# EAGLE design Ephys (EAGLE 9.6.2)
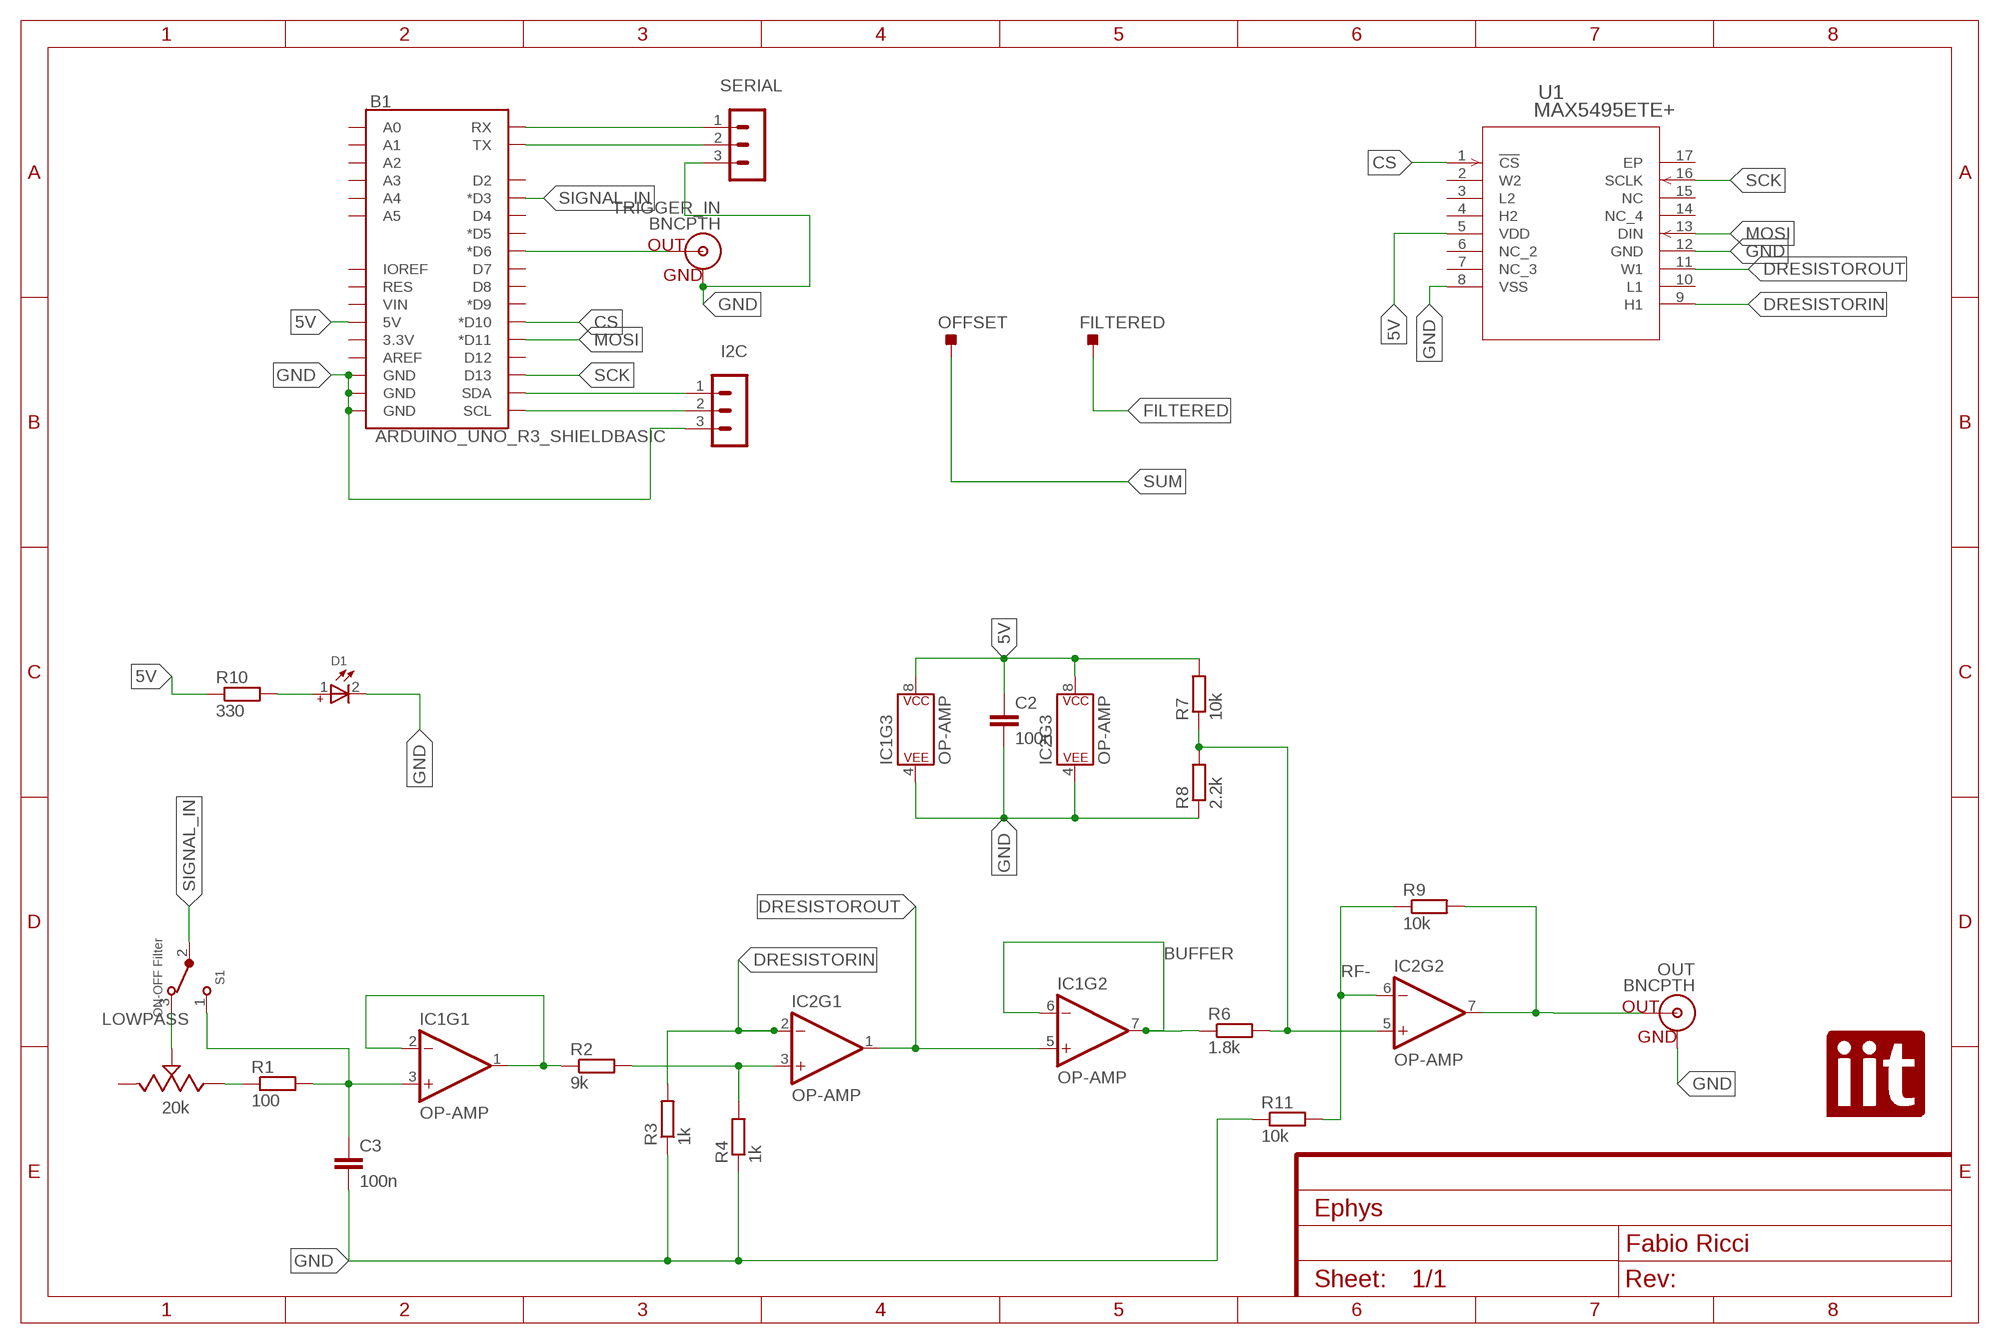
[diagram p0: schematic, sheet 1]
FRAME1 (FRAME-A4L): DESIGNER: Fabio Ricci

## Parts
B1  ARDUINO_UNO_R3_SHIELDBASIC  [UNO_R3_SHIELD]
C2  100n  C-EU025-025X050  [C025-025X050]
C3  100n  C-EU025-025X050  [C025-025X050]
D1  WL-TMRC_3MM_151031SS04000_WITHOUTSTOPPER  [WL-TMRC_3MM]
FILTERED  TESTPOINT_TPS-PAD-036  [TESTPOINT_PAD-036]
I2C  MA03-1  [MA03-1]
IC1  OP-AMP  OPAMP-DUALDIP  [DIP08]
IC2  OP-AMP  OPAMP-DUALDIP  [DIP08]
LOWPASS  20k  3362P-1-103LF  [3362P-1-103LF]
OFFSET  TESTPOINT_TPS-PAD-036  [TESTPOINT_PAD-036]
OUT  BNCPTH  [BNC]
R1  100  R-EU_0204/7  [0204/7]
R2  9k  R-EU_0204/7  [0204/7]
R3  1k  R-EU_0204/7  [0204/7]
R4  1k  R-EU_0204/7  [0204/7]
R6  1.8k  R-EU_0204/7  [0204/7]
R7  10k  R-EU_0204/7  [0204/7]
R8  2.2k  R-EU_0204/7  [0204/7]
R9  10k  R-EU_0204/7  [0204/7]
R10  330  R-EU_0204/7  [0204/7]
R11  10k  R-EU_0204/7  [0204/7]
S1  ON-OFF Filter  472121010111  [472121010111]
SERIAL  MA03-1  [MA03-1]
TRIGGER_IN  BNCPTH  [BNC]
U1  MAX5495ETE+  [21-0140_T1655+3_MXM]
U$1  LOGO  [IIT]

## Nets
5V: B1.5V C2.1 IC1.8(P$V+) IC2.8(P$V+) R7.2 R10.1 U1.5(VDD)
BUFFER: IC1.6(-IN) IC1.7(OUT) R6.1
CS: B1.D10(*D10) U1.1(!CS)
DRESISTORIN: IC2.2(-IN) R3.2 U1.9(H1)
DRESISTOROUT: IC1.5(+IN) IC2.1(OUT) U1.11(W1)
FILTERED: C3.1 FILTERED.1(TP) IC1.3(+IN) R1.2 S1.1
GND: B1.GND@0(GND) B1.GND@1(GND) B1.GND@2(GND) C2.2 C3.2 D1.2(-) I2C.3 IC1.4(P$V-) IC2.4(P$V-) OUT.GND R3.1 R4.1 R8.1 R11.1 SERIAL.3 TRIGGER_IN.GND U1.8(VSS) U1.12(GND)
MOSI: B1.D11(*D11) U1.13(DIN)
N$2: IC1.1(OUT) IC1.2(-IN) R2.1
N$3: IC2.3(+IN) R2.2 R4.2
N$4: B1.D6(*D6) TRIGGER_IN.S(OUT)
N$5: B1.SDA I2C.1
N$6: B1.SCL I2C.2
N$7: B1.RX SERIAL.1
N$8: LOWPASS.3 R1.1
N$9: D1.1(+) R10.2
N$10: LOWPASS.2 S1.3
N$11: B1.TX SERIAL.2
OUT: IC2.7(OUT) OUT.S(OUT) R9.2
RF-: IC2.6(-IN) R9.1 R11.2
SCK: B1.D13 U1.16(SCLK)
SIGNAL_IN: B1.D3(*D3) S1.2
SUM: IC2.5(+IN) OFFSET.1(TP) R6.2 R7.1 R8.2
Unconnected: B1.3.3V B1.A0 B1.A1 B1.A2 B1.A3 B1.A4 B1.A5 B1.AREF B1.D2 B1.D4 B1.D5(*D5) B1.D7 B1.D8 B1.D9(*D9) B1.D12 B1.IOREF B1.RES B1.VIN LOWPASS.1 U1.2(W2) U1.3(L2) U1.4(H2) U1.6(NC_2) U1.7(NC_3) U1.10(L1) U1.14(NC_4) U1.15(NC) U1.17(EP)

## Library data of the parts
B1 = SparkFun-Boards:ARDUINO_UNO_R3_SHIELD: Arduino R3 Shield Footprint Shield form compatible with the Arduino Uno R3. SparkFun Products: MG2639 Cellular Shield <https://www.sparkfun.com/products/13120> MIDI Shield <https://www.sparkfun.com/products/12898> R3 Stackable Headers Kit <https://www.sparkfun.com/products/11417>
C2 C3 = rcl:C-EU: CAPACITOR, European symbol; SPICEPREFIX: C
D1 = Wurth_LEDs_WL-TMRC:WL-TMRC_3MM: WL-TMRC THT Mono-color Round Color Characteristics Low energy consumption High reliability Low current requirement Fast switching No UV/IR radiation Easy installation LED without stopper Variety of lens colors Variety of viewing angle Applications Status light Light guide design Commercial advertising Decorative lighting Interior and exterior lighting Outdoor LED panels Instrumentation and front panel indicator Traffic signal light Electronic and communication appliance Toys <https://www.we-online.com/catalog/media/o64621v209%20Family_WL_TMRC_THT.jpg> Details see: www.we-online.com/katalog/WL-TMRC <www.we-online.com/catalog/WL-TMRC/?utm_source=eagle_model&utm_medium=description_link&utm_campaign=eisos_eagle> Updated by Ella Wu, 2022-06-21 2022(C) Wurth Elektronik; CHIP-TECHNOLOGY: AlInGaP; DATASHEET-URL: https://www.we-online.com/redexpert/spec/151031SS04000?ae; DOMINANT-WAVELENGTH: 635nm; EMITTING-COLOR: Super Red; FORWARD-VOLTAGE: 2V; LUMINOUS-INTENSITY: 160mcd; MOUNT: THT; PART-NUMBER: 151031SS04000; PEAK-WAVELENGTH: 640nm; VALUE: 151031SS04000; VIEWING-ANGLE: 40°
FILTERED OFFSET = 52101-101-REV-A_v16:TESTPOINT_TPS: TEST POINT PAD; BOM: EXCLUDE
I2C SERIAL = con-lstb:MA03-1: PIN HEADER; OC_FARNELL: unknown; OC_NEWARK: unknown
IC1 IC2 = SparkFun-IC-Amplifiers:OPAMP-DUAL: Generic op-amp footprint This component is for the standard 358 pinning of a dual op-amp From the LM358 datasheet: Pin 1: Output A Pin 2: Inverting Input A Pin 3: Non-Inverting Input A Pin 4: Gnd Pin 5: Non-Inverting Input B Pin 6: Inverting Input B Pin 7: Output B Pin 8: V+; PROD_ID: NA-XXXXX
LOWPASS = Potentiometer_Trimmers:3362P-1-103LF: TRIMMER 10K OHM 0.5W PC PIN TOP Manufacturer's datasheet <https://www.bourns.com/docs/Product-Datasheets/3362.pdf>; CREATED_PN: PCBLayout.com; DIGIKEY_PN: 3362P-103LF-ND; MANUFACTURER: Bourns Inc.; MPN: 3362P-1-103LF
OUT TRIGGER_IN = SparkFun-Connectors:BNC: BNC Right Angle Connector Mouser Part# 5227161 SparkFun Products: BNC Connector - Right Angle <https://www.sparkfun.com/products/10550>; PROD_ID: LPA-12729; SF_ID: PRT-10550
R1-R4 R6-R11 = resistor:R-EU_: RESISTOR, European symbol
S1 = Wurth_Switch_WS-TOTV:472121010111: WS-TOTV Ø 6.35mm Panel Cut-Out Vertical Operation Toggle Switch Material Properties Actuator Material Copper Alloy Cover Material Stainless Steel Frame Material DAP Frame Flammability Rating UL94 V-0 Moveable Contact Material Copper Alloy Moveable Contact Plating Silver Stationary Contact Material Copper Alloy Stationary Contact Plating Silver Terminal Material Copper Alloy Terminal Plating Silver Electrical Properties IR 1 A VR 30 V (DC) Contact Resistance Initial 30 mΩ RISO 1000 MΩ Withstanding Voltage 500 V (AC) Mechanical Properties Electrical Life 50000 Steps Connection Type Opposite Side Connection General Information Operating Temperature -40 up to +85 °C <https://www.we-online.com/catalog/media/o718996v209%20family-totv-4721xx0x0xxx.jpg> Details see: www.we-online.com/components/products/WS-TOTV_635_CUT_OUT_VERT_OPERATION <https://www.we-online.com/en/components/products/WS-TOTV_635_CUT_OUT_VERT_OPERATION> Updated by Ella Wu 2022-11-11 2022(C) Würth Elektronik; ACTUATOR-LENGTH: 10.4mm; BUSHING-LENGTH: 9mm; DATASHEET-URL: https://www.we-online.com/redexpert/spec/472121010111?ae; MOUNT: THT; PART-NUMBER: 472121010111; SWITCHING-FUNCTION: ON-ON; VALUE: 472121010111
U1 = Max5495:MAX5495ETE+; COPYRIGHT: Copyright (C) 2024 Ultra Librarian. All rights reserved.; MANUFACTURER_PART_NUMBER: MAX5495ETE+; MFR_NAME: Analog Devices Inc
U$1 = LOGO:LOGO

## Board
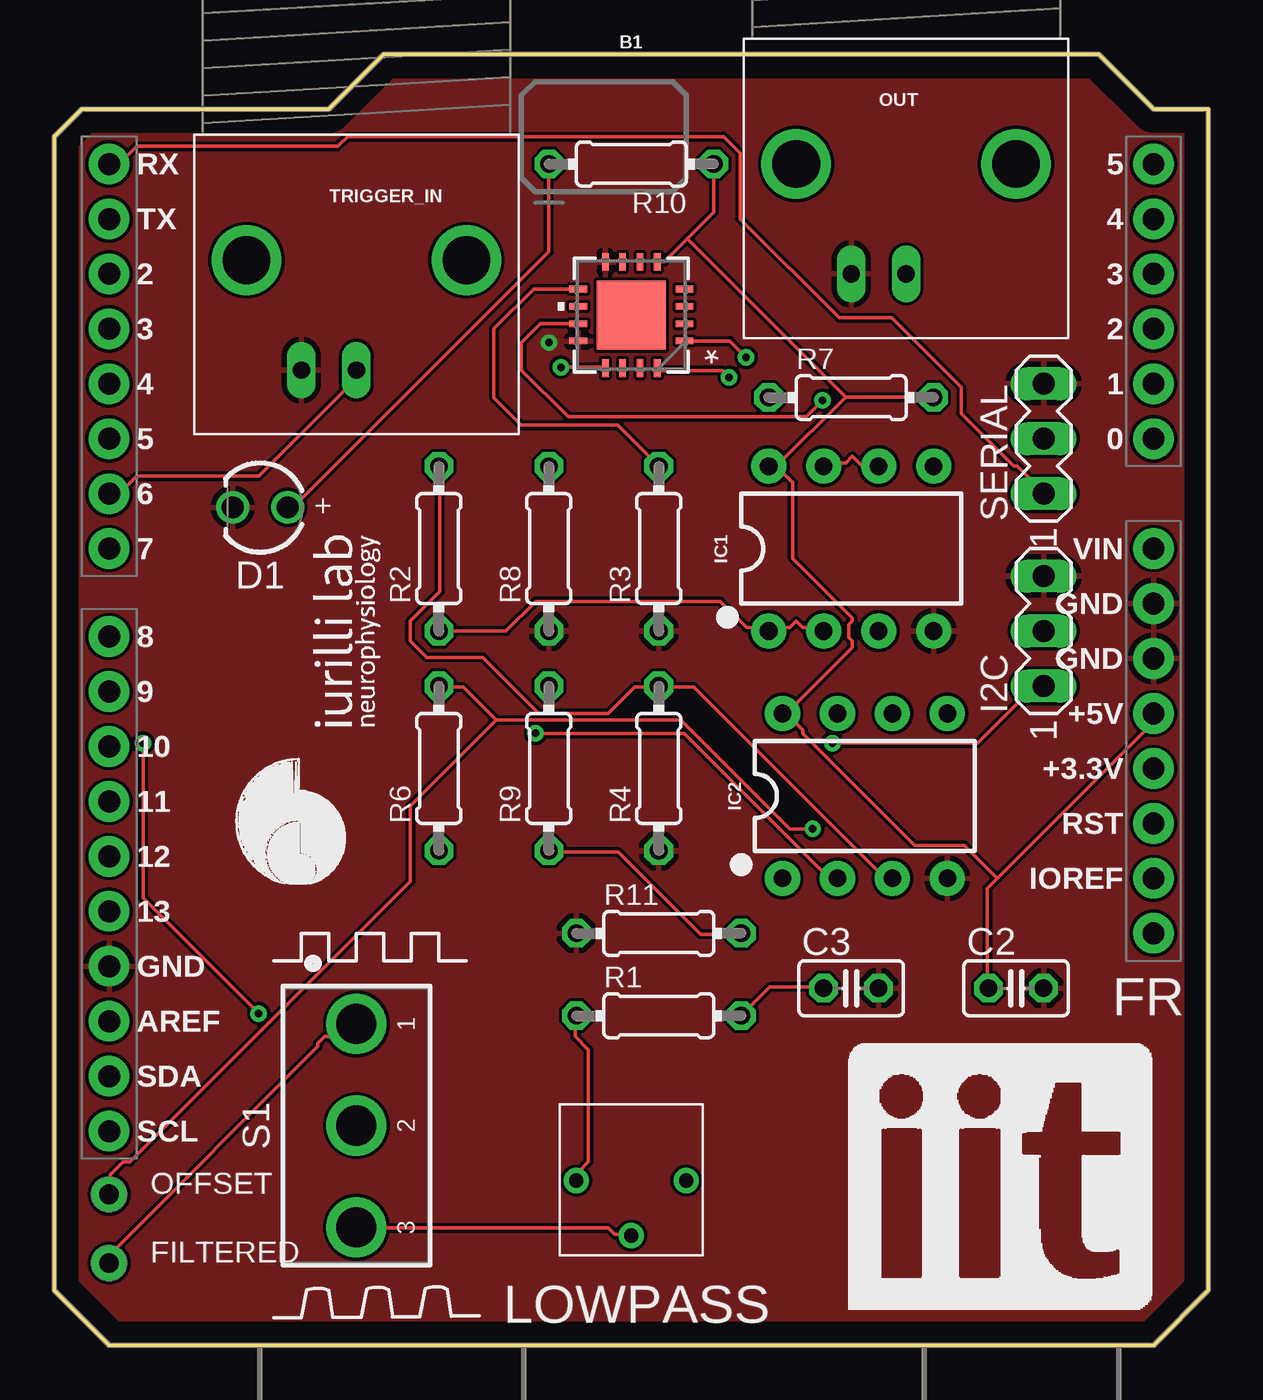
[diagram p1: board, top side]
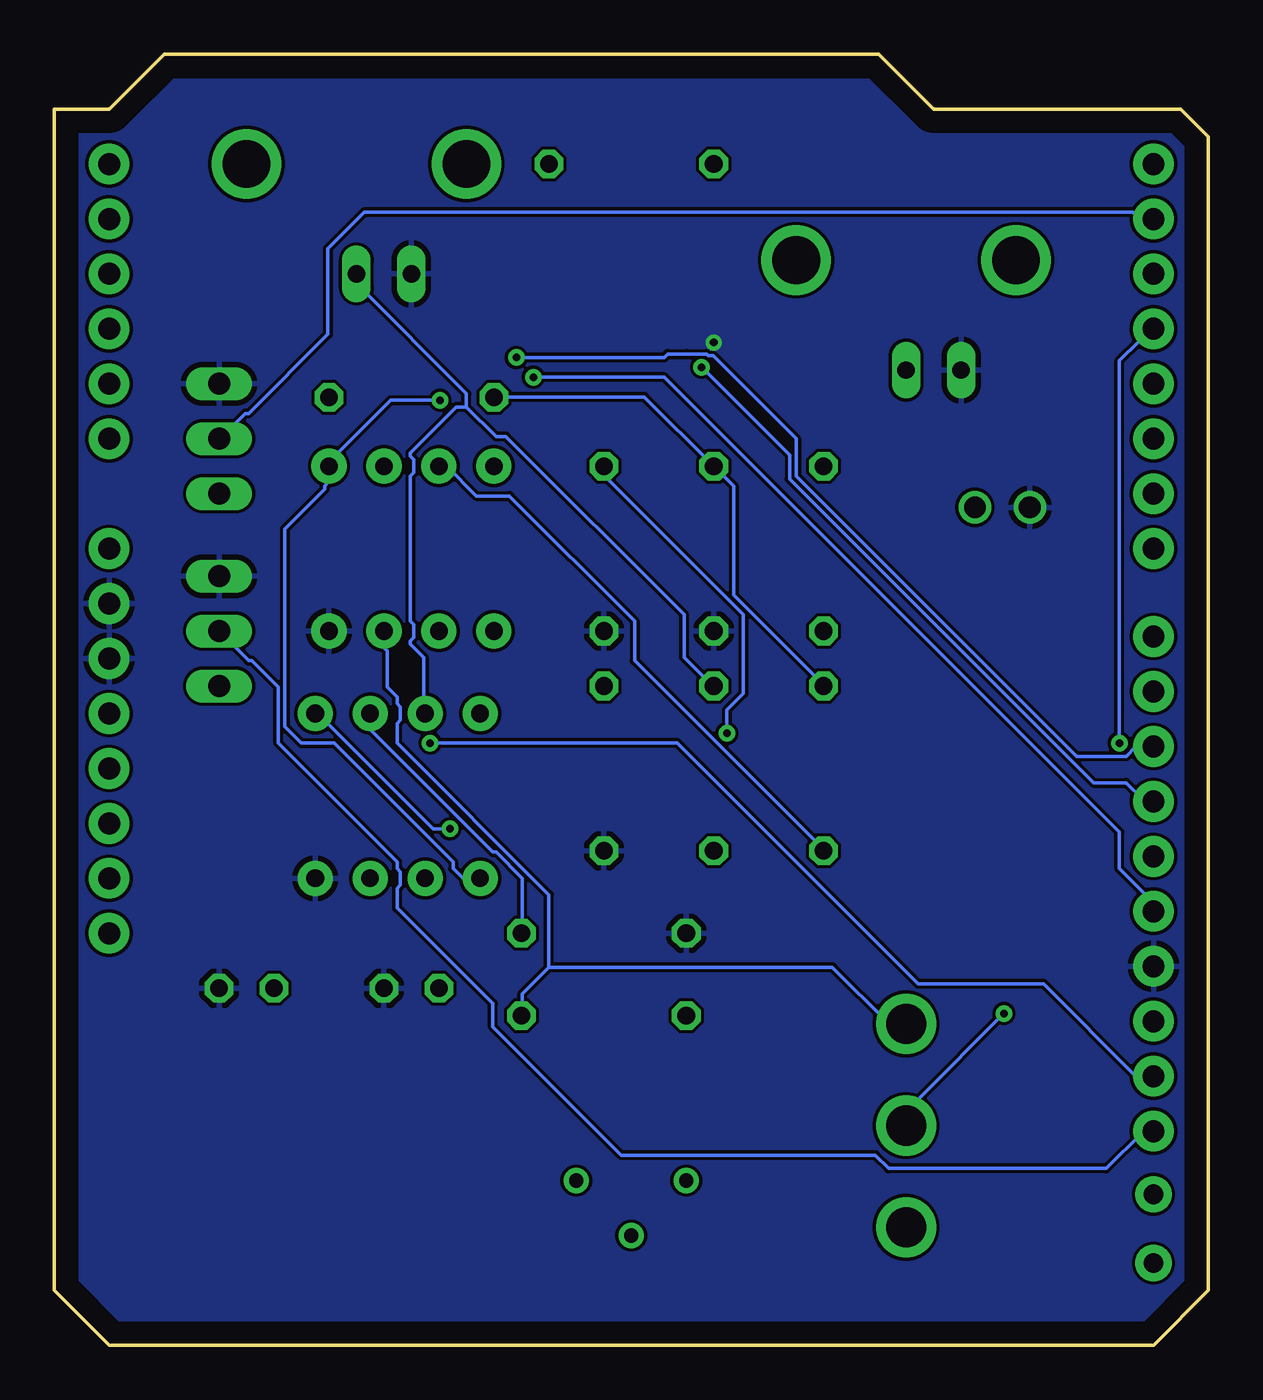
[diagram p2: board, bottom side, seen from below]

Size 53.34 x 59.69 mm. Coordinates in mm from the lower left corner, seen from the top.
Outline: 0,55.88 0,2.54 2.54,0 50.8,0 53.34,2.54 53.34,57.15 50.8,57.15 48.26,59.69 15.24,59.69 12.7,57.15 1.27,57.15 0,55.88
Copper layers (1*16): Top 0.035mm / dielectric 1.5mm / Bottom 0.035mm
Design rules "default": minimum track width 6mil, minimum drill 0.35mm, track to track 6mil, track to pad 6mil, pad to pad 6mil, via to via 6mil, smd to smd 6mil, copper to edge 40mil, drill to drill 6mil, minimum pad ring 10mil, minimum via ring 8mil, stop-mask expansion 4mil, vias tented up to drill 0mil, thermal gap 10mil

### Footprints (pad centres in the part's own frame; a part is rotated, then mirrored left to right if it is on the bottom)
UNO_R3_SHIELD = drill 1.016 pad 1.88: 3.3V 24.13,-2.54; 5V 24.13,0; A0 24.13,12.7; A1 24.13,15.24; A2 24.13,17.78; A3 24.13,20.32; A4 24.13,22.86; A5 24.13,25.4; AREF -24.13,-14.224; D2 -24.13,20.32; D3 -24.13,17.78; D4 -24.13,15.24; D5 -24.13,12.7; D6 -24.13,10.16; D7 -24.13,7.62; D8 -24.13,3.556; D9 -24.13,1.016; D10 -24.13,-1.524; D11 -24.13,-4.064; D12 -24.13,-6.604; D13 -24.13,-9.144; GND@0 24.13,2.54; GND@1 24.13,5.08; GND@2 -24.13,-11.684; IOREF 24.13,-7.62; NC 24.13,-10.16; RES 24.13,-5.08; RX -24.13,25.4; SCL -24.13,-19.304; SDA -24.13,-16.764; TX -24.13,22.86; VIN 24.13,7.62
C025-025X050 = drill 0.813 octagon: 1 -1.27,0; 2 1.27,0
WL-TMRC_3MM = drill 1: 1 -1.27,0; 2 1.27,0
TESTPOINT_PAD-036 = drill 0.914 pad 1.676: 1 0,0
MA03-1 = drill 1.016 long: 1 -2.54,0; 2 0,0; 3 2.54,0
DIP08 = drill 0.813 pad 1.626: 1 -3.81,-3.81; 2 -1.27,-3.81; 3 1.27,-3.81; 4 3.81,-3.81; 5 3.81,3.81; 6 1.27,3.81; 7 -1.27,3.81; 8 -3.81,3.81
3362P-1-103LF = drill 0.66: 1 -2.54,0; 2 0,2.54; 3 2.54,0
BNC = drill 2.2: 3 -5.08,5.08; 4 5.08,5.08 | drill 0.8 long: GND -2.54,0; S 0,0
0204/7 = drill 0.813 octagon: 1 -3.81,0; 2 3.81,0
472121010111 = drill 1.85: 1 4.7,0; 2 0,0; 3 -4.7,0
21-0140_T1655+3_MXM = smd 0.813 x 0.305: 1 -2.451,1.2; 2 -2.451,0.4; 3 -2.451,-0.4; 4 -2.451,-1.2; 9 2.451,-1.2; 10 2.451,-0.4; 11 2.451,0.4; 12 2.451,1.2 | smd 0.305 x 0.813: 5 -1.2,-2.451; 6 -0.4,-2.451; 7 0.4,-2.451; 8 1.2,-2.451; 13 1.2,2.451; 14 0.4,2.451; 15 -0.4,2.451; 16 -1.2,2.451 | smd 3.2 x 3.2: 17 0,0

### Placement (x,y rotation side)
B1  26.67,29.21 0 top
C2  44.45,16.51 0 top
C3  36.83,16.51 0 top
D1  9.52,38.73 180 top
FILTERED  2.54,3.81 0 top
I2C  45.72,33.02 90 top
IC1  36.83,36.83 0 top
IC2  37.47,25.4 0 top
LOWPASS  26.67,7.62 180 top
OFFSET  2.54,6.98 0 top
OUT  39.37,49.53 0 top
R1  27.94,15.24 0 top
R2  17.78,36.83 90 top
R3  27.94,36.83 90 top
R4  27.94,26.67 90 top
R6  17.78,26.67 90 top
R7  36.83,43.81 0 top
R8  22.86,36.83 90 top
R9  22.86,26.67 90 top
R10  26.67,54.61 180 top
R11  27.94,19.05 0 top
S1  13.97,10.16 90 top
SERIAL  45.72,41.91 90 top
TRIGGER_IN  13.97,45.08 0 top
U1  26.67,47.62 180 top
U$1  35.56,1.27 0 top
U$2  [IURILLI]  13.33,26.67 90 top

### Tracks (layer width: path | path; a pad name or v marks a point on that pad's centre or on a via)
5V
  Top 0.152: 29.26,51.16 30.48,52.38 30.48,54.51 R10.1 | 29.26,51.16 28.19,50.09 27.89,50.09 U1.5 | 36.58,43.84 40.54,43.84 R7.2 | 33.38,40.64 36.58,43.84 | 33.38,40.64 33.07,40.64 IC1.8 33.38,40.64 | 36.58,43.84 29.26,51.16 | 43.59,21.59 50.75,28.75 50.75,29.21 B1.5V | 43.59,21.59 43.13,21.13 43.13,16.56 C2.1 | 33.68,29.21 34.14,28.75 34.29,28.75 34.59,28.45 34.59,28.3 39.78,23.11 42.06,23.11 43.59,21.59 | 33.68,29.21 IC2.8 33.68,29.21 | 33.38,40.64 34.14,39.88 34.14,36.37 36.88,33.63 36.88,33.48 36.73,33.33 36.73,32.72 36.88,32.56 36.88,32.26 33.83,29.21 33.68,29.21
BUFFER
  Top 0.152: IC1.6 37.34,40.64 36.88,41.1 36.58,40.79 35.81,40.79 35.66,40.64 IC1.7
  Bottom 0.152: R6.1 17.83,22.96 26.52,31.65 26.52,33.48 32.31,39.27 33.83,39.27 35.2,40.64 35.51,40.64 IC1.7
CS  (via drill 0.35)
  Top 0.152: v31.98,45.67 31.22,46.42 U1.1
  Bottom 0.152: v31.98,45.67 25.15,45.67 24.99,45.82 24.13,45.82 23.19,45.82 23.11,45.75 22.89,45.75 19.05,41.91 19.05,40.18 6.1,27.23 3.81,27.23 3.35,27.69 2.59,27.69 B1.D10
DRESISTORIN  (via drill 0.35)
  Top 0.152: v22.25,28.3 29.11,28.3 35.81,21.59 36.12,21.59 IC2.2 | U1.9 22.16,48.83 20.32,46.99 20.32,43.81 21.59,42.55 26.03,42.55 R3.2
  Bottom 0.152: v22.25,28.3 22.25,29.36 21.49,30.12 21.49,33.78 27.89,40.18 27.89,40.64 R3.2
DRESISTOROUT  (via drill 0.35)
  Top 0.152: U1.11 22.46,47.22 21.59,46.36 21.59,45.08 23.75,42.93 34.75,42.93 v35.51,43.69
  Bottom 0.152: v35.51,43.69 37.79,43.69 40.54,40.94 40.54,40.64 IC1.5 40.69,40.64 40.69,39.88 40.84,39.73 40.84,39.57 42.67,37.74 42.67,28.6 41.91,27.84 40.39,27.84 34.9,22.35 34.9,22.05 34.44,21.59 33.68,21.59 IC2.1
FILTERED
  Top 0.152: R1.2 31.85,15.34 33.07,16.56 35.51,16.56 C3.1 | FILTERED.1 2.59,3.91 2.59,4.22 12.19,13.82 12.19,13.97 12.5,14.27 13.41,14.27 13.87,14.73 S1.1
  Bottom 0.152: IC1.3 38.1,32.26 37.95,32.11 37.95,30.43 37.49,29.97 37.49,29.67 37.34,29.52 37.34,28.91 37.49,28.75 37.49,27.84 30.48,20.83 30.48,17.47 | 30.48,17.47 31.7,16.26 31.7,15.34 R1.2 | 30.48,17.47 17.37,17.47 14.78,14.88 14.02,14.88 S1.1
GND  (via drill 0.35)
  other vias: 22.86,46.36
  pour Top: 1.27,56.52 13.33,56.52 15.88,59.05 47.62,59.05 50.16,56.52 52.7,56.52 52.7,3.17 50.16,0.63 3.17,0.63 0.63,3.17 0.63,55.88
  pour Bottom: 1.27,56.52 13.33,56.52 15.88,59.05 47.62,59.05 50.16,56.52 52.7,56.52 52.7,3.17 50.16,0.63 3.17,0.63 0.63,3.17 0.63,55.88
MOSI  (via drill 0.35)
  Top 0.152: v23.42,45.21 25.45,45.21 U1.13
  Bottom 0.152: B1.D11 2.59,25.25 3.05,25.25 3.81,26.01 5.31,26.01 19.36,40.06 19.36,41.15 v23.42,45.21
N$2
  Top 0.152: R2.1 17.83,33.02 20.88,33.02 22.25,34.39 30.78,34.39 32,33.17 32.77,33.17 32.92,33.02 IC1.1 33.07,33.02 33.22,33.17 33.98,33.17 34.29,33.48 34.59,33.17 34.75,33.17 34.9,33.02 35.51,33.02 IC1.2
N$3
  Top 0.152: IC2.3 38.71,21.59 38.41,21.59 29.57,30.43 28.04,30.43 R4.2 27.89,30.43 26.82,30.43 25.6,29.21 22.4,29.21 19.81,31.8 17.22,31.8 16.46,32.56 16.46,33.48 17.83,34.85 17.83,40.64 R2.2
N$4
  Top 0.152: TRIGGER_IN.S 13.87,45.06 13.87,44.6 9.45,40.18 3.81,40.18 3.05,39.42 2.59,39.42 B1.D6
N$5  (via drill 0.35)
  Top 0.152: v35.97,27.84 42.67,27.84 45.26,30.43 45.72,30.43 I2C.1
  Bottom 0.152: v35.97,27.84 24.54,27.84 13.41,16.71 7.62,16.71 3.35,12.45 2.59,12.45 B1.SDA
N$6
  Bottom 0.152: I2C.2 44.35,31.65 44.2,31.65 42.98,30.43 42.98,27.84 37.49,22.35 37.49,22.05 37.34,21.89 37.34,21.28 37.49,21.13 37.49,20.22 33.07,15.8 33.07,14.73 27.13,8.79 15.39,8.79 14.78,8.18 4.72,8.18 3.05,9.85 2.59,9.85 B1.SCL
N$7
  Top 0.152: SERIAL.1 45.72,39.42 44.5,40.64 44.35,40.64 41.91,43.08 41.91,44.3 38.71,47.5 36.27,47.5 31.7,52.07 31.7,55.12 30.94,55.88 13.56,55.88 13.11,55.42 3.81,55.42 3.05,54.66 2.59,54.66 B1.RX
N$8
  Top 0.152: LOWPASS.3 24.23,7.72 24.23,8.03 24.69,8.48 24.69,13.66 24.08,14.27 24.08,15.19 R1.1
N$9
  Top 0.152: R10.2 22.86,54.51 22.86,50.55 11.12,38.81 10.82,38.81 D1.1
N$10
  Top 0.152: LOWPASS.2 26.67,5.13 25.91,5.13 25.6,5.44 14.02,5.44 S1.3
N$11
  Bottom 0.152: SERIAL.2 45.72,42.01 45.26,42.47 45.11,42.47 44.5,43.08 44.35,43.08 40.69,46.74 40.69,50.7 39.01,52.38 3.5,52.38 3.2,52.07 2.59,52.07 B1.TX
OUT
  Bottom 0.152: 34.29,43.38 34.29,43.99 39.32,49.02 39.32,49.48 OUT.S | 34.29,43.38 32.92,42.01 32.46,42.01 24.23,33.78 24.23,31.8 22.86,30.43 R9.2 | 34.29,43.38 34.75,43.38 36.88,41.25 36.88,41.1 36.73,40.94 36.73,40.33 36.88,40.18 36.88,33.48 36.73,33.33 36.73,32.72 36.88,32.56 36.88,32.41 36.27,31.8 36.27,29.21 IC2.7
RF-
  Top 0.152: R9.1 22.86,22.81 26.06,22.81 29.87,19 31.7,19 R11.2
  Bottom 0.152: IC2.6 38.71,29.21 38.71,28.45 33.07,22.81 32.92,22.81 31.7,21.59 31.7,19.15 R11.2
SCK  (via drill 0.35)
  Top 0.152: v31.19,44.75 30.89,45.06 27.89,45.06 U1.16
  Bottom 0.152: v31.19,44.75 25.15,44.75 4.11,23.72 4.11,22.05 2.59,20.52 2.59,20.07 B1.D13
SIGNAL_IN  (via drill 0.35)
  Top 0.152: v4.11,27.84 4.11,20.68 v9.45,15.34
  Bottom 0.152: v4.11,27.84 4.11,45.52 3.2,46.43 3.05,46.43 2.59,46.89 B1.D3 | v9.45,15.34 13.41,11.38 13.26,11.23 13.26,10.77 13.87,10.16 S1.2
SUM  (via drill 0.35)
  Top 0.152: v35.05,23.88 33.98,23.88 28.96,28.91 20.42,28.91 | 20.42,28.91 18.9,30.43 17.83,30.43 R6.2 | 20.42,28.91 16.46,24.94 16.46,21.44 3.5,8.48 3.2,8.48 2.59,7.87 2.59,7.11 OFFSET.1
  Bottom 0.152: R6.2 17.83,30.58 21.95,34.7 21.95,39.73 R8.2 26.06,43.84 32.92,43.84 R7.1 | v35.05,23.88 35.81,23.88 41.15,29.21 IC2.5

### Text on the board
tPlace: FR